# EAGLE design Bus Stop Kiosk Rev. 2 (EAGLE 7.4.0)
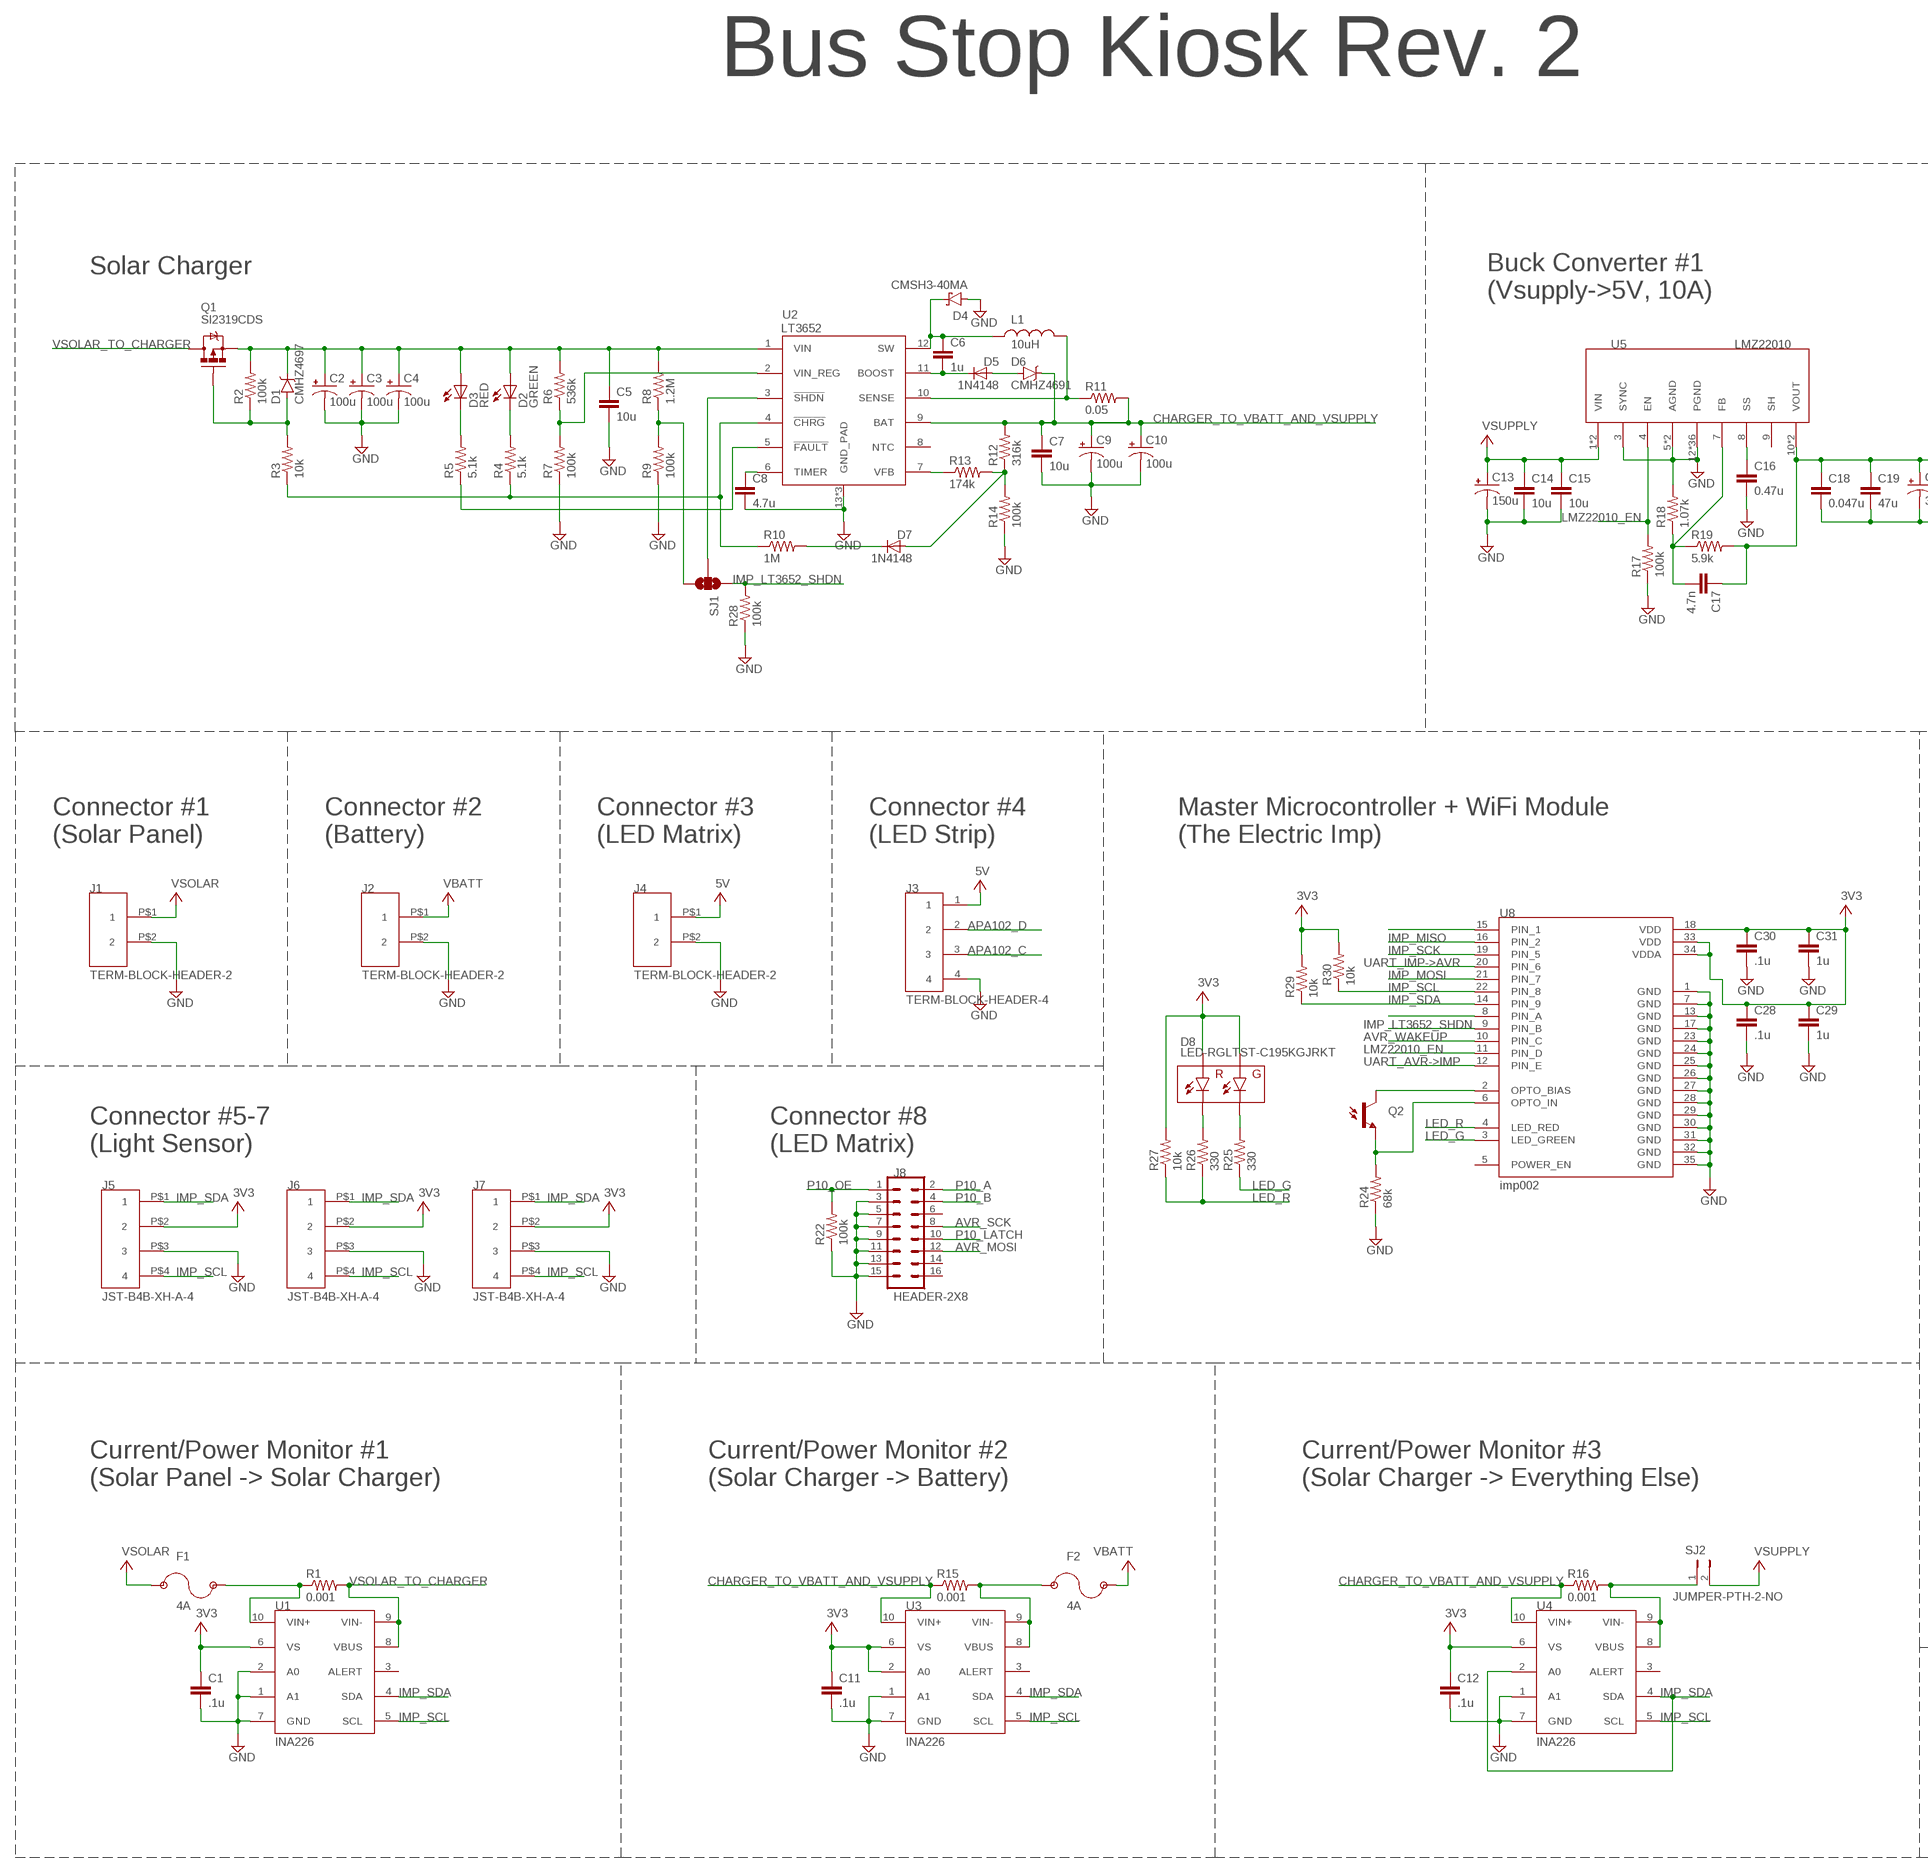
[diagram p0: schematic, sheet 1, part 1 of 2]
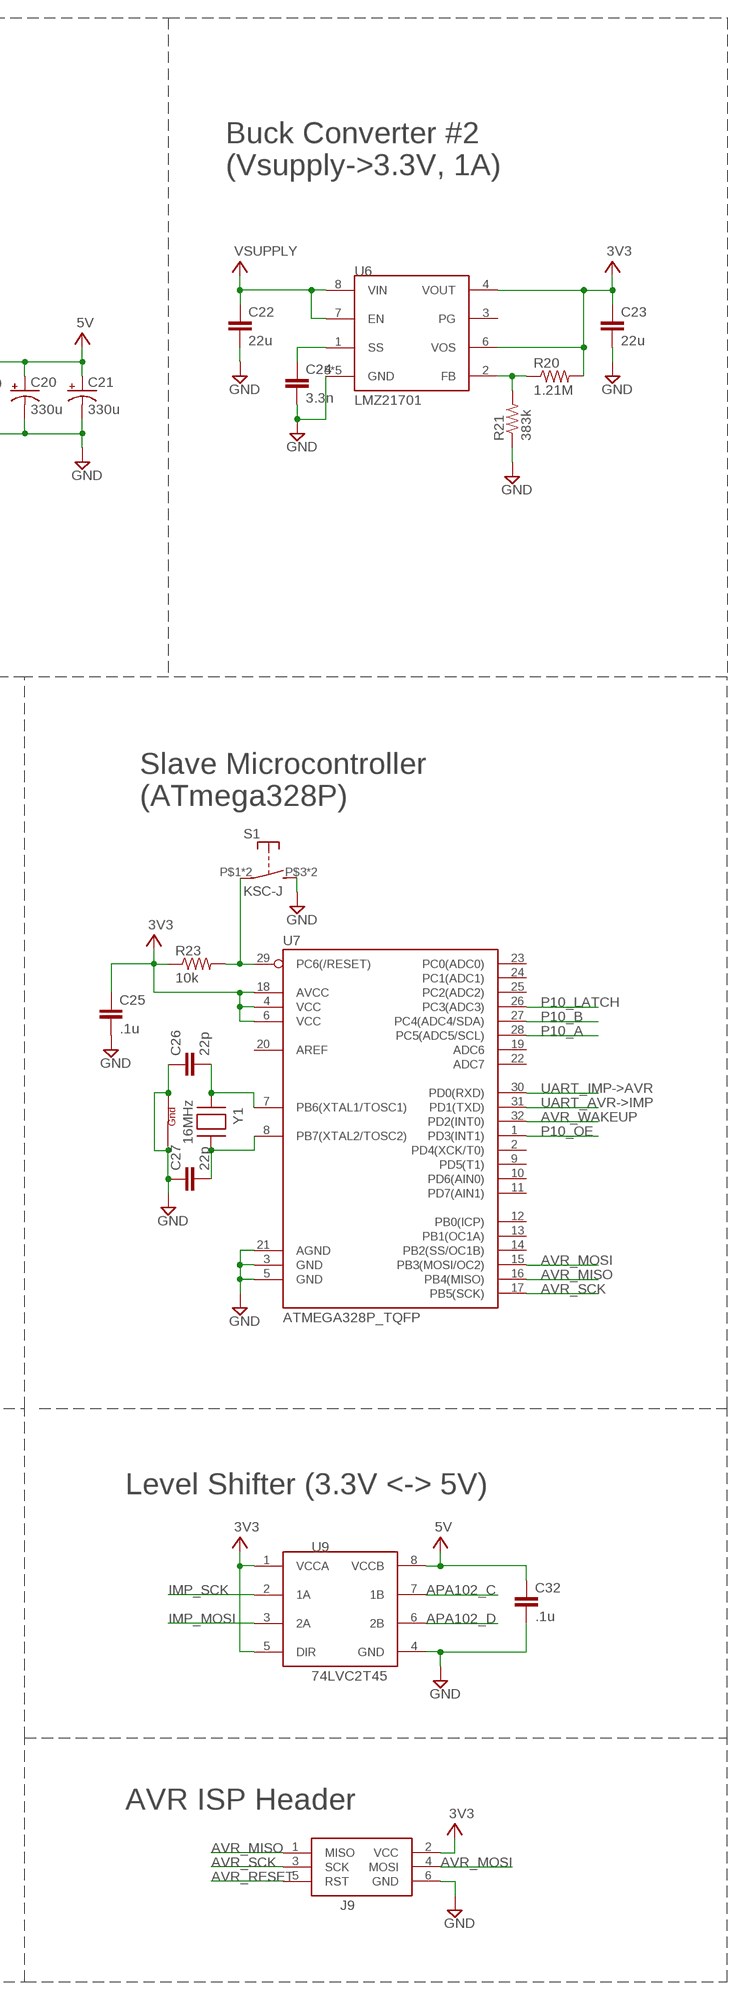
[diagram p1: schematic, sheet 1, part 2 of 2]

## Parts
C1  .1u  C-EUC0603K  [C0603K]
C2  100u  CAP_POL7343  [EIA7343]
C3  100u  CAP_POL7343  [EIA7343]
C4  100u  CAP_POL7343  [EIA7343]
C5  10u  C-EUC1210K  [C1210K]
C6  1u  C-EUC0805K  [C0805K]
C7  10u  C-EUC1210K  [C1210K]
C8  4.7u  C-EUC0603K  [C0603K]
C9  100u  CAP_POL7343  [EIA7343]
C10  100u  CAP_POL7343  [EIA7343]
C11  .1u  C-EUC0603K  [C0603K]
C12  .1u  C-EUC0603K  [C0603K]
C13  150u  CAP_POLG  [PANASONIC_G]
C14  10u  C-EUC1210K  [C1210K]
C15  10u  C-EUC1210K  [C1210K]
C16  0.47u  C-EUC0603K  [C0603K]
C17  4.7n  C-EUC0603K  [C0603K]
C18  0.047u  C-EUC1206K  [C1206K]
C19  47u  C-EUC1210K  [C1210K]
C20  330u  CAP_POL7343  [EIA7343]
C21  330u  CAP_POL7343  [EIA7343]
C22  22u  C-EUC1210K  [C1210K]
C23  22u  C-EUC0805K  [C0805K]
C24  3.3n  C-EUC0603K  [C0603K]
C25  .1u  C-EUC0603K  [C0603K]
C26  22p  C-EUC0603K  [C0603K]
C27  22p  C-EUC0603K  [C0603K]
C28  .1u  C-EUC0603K  [C0603K]
C29  1u  C-EUC0603K  [C0603K]
C30  .1u  C-EUC0603K  [C0603K]
C31  1u  C-EUC0603K  [C0603K]
C32  .1u  C-EUC0603K  [C0603K]
D1  CMHZ4697  [SOD-123]
D2  GREEN  LEDCHIP-LED0603  [CHIP-LED0603]
D3  RED  LEDCHIP-LED0603  [CHIP-LED0603]
D4  CMSH3-40MA  DIODE-SCHOTTKY-B340A  [SMA-DIODE]
D5  1N4148  [SOD-123]
D6  CMHZ4691  [SOD-123]
D7  1N4148  [SOD-123]
D8  LED-RGLTST-C195KGJRKT  [LTST-C195KGJRKT]
F1  4A  FUSE  [0603]
F2  4A  FUSE  [0603]
J1  TERM-BLOCK-HEADER-2  [TERM-BLOCK-HDR-2]
J2  TERM-BLOCK-HEADER-2  [TERM-BLOCK-HDR-2]
J3  TERM-BLOCK-HEADER-4  [OSTOQ045451]
J4  TERM-BLOCK-HEADER-2  [TERM-BLOCK-HDR-2]
J5  JST-B4B-XH-A-4  [JST-B4B-XH-A-4]
J6  JST-B4B-XH-A-4  [JST-B4B-XH-A-4]
J7  JST-B4B-XH-A-4  [JST-B4B-XH-A-4]
J8  HEADER-2X8  [HEADER-2X8-SHROUDED]
J9  AVRISP-6  [AVRISP]
L1  10uH  IHLP-2525CZ-01  [INDUCTOR-6.86X6.47]
Q1  SI2319CDS  [SOT-23-3]
Q2  PHOTOTRANSISTORPT17-21C-L41-TR8  [PT17-21C-L41-TR8]
R1  0.001  R-US_R1206  [R1206]
R2  100k  R-US_R0603  [R0603]
R3  10k  R-US_R0603  [R0603]
R4  5.1k  R-US_R0402  [R0402]
R5  5.1k  R-US_R0402  [R0402]
R6  536k  R-US_R0402  [R0402]
R7  100k  R-US_R0402  [R0402]
R8  1.2M  R-US_R0402  [R0402]
R9  100k  R-US_R0402  [R0402]
R10  1M  R-US_R0402  [R0402]
R11  0.05  R-US_R1206  [R1206]
R12  316k  R-US_R0603  [R0603]
R13  174k  R-US_R0402  [R0402]
R14  100k  R-US_R0603  [R0603]
R15  0.001  R-US_R1206  [R1206]
R16  0.001  R-US_R1206  [R1206]
R17  100k  R-US_R0603  [R0603]
R18  1.07k  R-US_R0603  [R0603]
R19  5.9k  R-US_R0603  [R0603]
R20  1.21M  R-US_R0603  [R0603]
R21  383k  R-US_R0603  [R0603]
R22  100k  R-US_R0603  [R0603]
R23  10k  R-US_R0603  [R0603]
R24  68k  R-US_R0603  [R0603]
R25  330  R-US_R0603  [R0603]
R26  330  R-US_R0603  [R0603]
R27  10k  R-US_R0603  [R0603]
R28  100k  R-US_R0603  [R0603]
R29  10k  R-US_R0603  [R0603]
R30  10k  R-US_R0603  [R0603]
S1  KSC-J  [C&K-KSC]
SJ1  JUMPER-PAD-3-NOYES_SILK  [PAD-JUMPER-3-NO_YES_SILK]
SJ2  JUMPER-PTH-2-NO  [PTH-JUMPER-2-NO_NO_SILK]
U1  INA226  [VSSOP-10]
U2  LT3652  [MSOP-12_GND]
U3  INA226  [VSSOP-10]
U4  INA226  [VSSOP-10]
U5  LMZ22010  [TO-PMOD-11]
U6  LMZ21701  [SIL0008E]
U7  ATMEGA328P_TQFP  [TQFP32-08]
U8  imp002  ELECTRIC_IMP_IMP002  [ELECTRIC_IMP_IMP002]
U9  74LVC2T45  [VSSOP-8]
Y1  16MHz  XTAL-4-3225  [NX3225]

## Nets
3V3: C1.1 C11.1 C12.1 C23.1 C25.1 C28.1 C29.1 C30.1 C31.1 D8.P$1(GA) D8.P$2(RA) J5.P$2 J6.P$2 J7.P$2 J9.2(VCC) R20.2 R23.1 R27.2 R29.2 R30.2 U1.6(VS) U3.2(A0) U3.6(VS) U4.6(VS) U6.4(VOUT) U6.6(VOS) U7.4(VCC) U7.6(VCC) U7.18(AVCC) U8.18(VDD) U8.33(VDD) U8.34(VDDA) U9.1(VCCA) U9.5(DIR)
5V: C17.1 C18.1 C19.1 C20.A(+) C21.A(+) C32.1 J3.1 J4.P$1 R19.2 U5.10(VOUT) U5.11(VOUT) U9.8(VCCB)
ADC1: U8.8(PIN_A)
APA102_C: J3.3 U9.7(1B)
APA102_D: J3.2 U9.6(2B)
AVR_MISO: J9.1(MISO) U7.16(PB4(MISO))
AVR_MOSI: J8.12 J9.4(MOSI) U7.15(PB3(MOSI/OC2))
AVR_RESET: J9.5(RST) R23.2 S1.P$1(P) S1.P$2(P) U7.29(PC6(/RESET))
AVR_SCK: J8.8 J9.3(SCK) U7.17(PB5(SCK))
AVR_WAKEUP: U7.32(PD2(INT0)) U8.10(PIN_C)
BOOST: C6.2 D5.C U2.11(BOOST)
C21: C26.2 U7.7(PB6(XTAL1/TOSC1)) Y1.1(X1)
CHARGER_TO_VBATT_AND_VSUPPLY: C7.1 C9.A(+) C10.A(+) D6.C R11.2 R12.2 R15.1 R16.1 U2.9(BAT) U3.10(VIN+) U4.10(VIN+)
CHRG: R3.1 R4.1 R10.1 U2.4(!CHRG)
FAULT: R5.1 U2.5(!FAULT)
GND: C1.2 C2.C(-) C3.C(-) C4.C(-) C5.2 C7.2 C8.2 C9.C(-) C10.C(-) C11.2 C12.2 C13.- C14.2 C15.2 C16.2 C18.2 C19.2 C20.C(-) C21.C(-) C22.2 C23.2 C24.2 C25.2 C26.1 C27.1 C28.2 C29.2 C30.2 C31.2 C32.2 D4.A J1.P$2 J2.P$2 J3.4 J4.P$2 J5.P$3 J6.P$3 J7.P$3 J8.3 J8.5 J8.7 J8.9 J8.11 J8.13 J8.15 J9.6(GND) R7.1 R9.1 R14.1 R17.1 R18.2 R21.1 R22.1 R24.1 R28.1 S1.P$3(S) S1.P$4(S) U1.1(A1) U1.2(A0) U1.7(GND) U2.13(GND_PAD) U2.P$1(GND_PAD) U2.P$2(GND_PAD) U3.1(A1) U3.7(GND) U4.1(A1) U4.7(GND) U5.3(SYNC) U5.5(AGND) U5.6(AGND) U5.12(PGND) U5.P$1(PGND) U5.P$2(PGND) U5.P$3(PGND) U5.P$4(PGND) U5.P$5(PGND) U5.P$6(PGND) U5.P$7(PGND) U5.P$8(PGND) U5.P$9(PGND) U5.P$10(PGND) U5.P$11(PGND) U5.P$12(PGND) U5.P$13(PGND) U5.P$14(PGND) U5.P$15(PGND) U5.P$16(PGND) U5.P$17(PGND) U5.P$18(PGND) U5.P$19(PGND) U5.P$20(PGND) U5.P$21(PGND) U5.P$22(PGND) U5.P$23(PGND) U5.P$24(PGND) U5.P$25(PGND) U5.P$26(PGND) U5.P$27(PGND) U5.P$28(PGND) U5.P$29(PGND) U5.P$30(PGND) U5.P$31(PGND) U5.P$32(PGND) U5.P$33(PGND) U5.P$34(PGND) U5.P$35(PGND) U6.5(GND) U6.9(GND) U6.10(GND) U6.11(GND) U6.12(GND) U7.3(GND) U7.5(GND) U7.21(AGND) U8.1(GND) U8.7(GND) U8.13(GND) U8.17(GND) U8.23(GND) U8.24(GND) U8.25(GND) U8.26(GND) U8.27(GND) U8.28(GND) U8.29(GND) U8.30(GND) U8.31(GND) U8.32(GND) U8.35(GND) U9.4(GND) Y1.2(G2) Y1.4(G1)
IMP_LT3652_SHDN: R28.2 SJ1.1 U8.9(PIN_B)
IMP_MISO: U8.16(PIN_2)
IMP_MOSI: U8.21(PIN_7) U9.3(2A)
IMP_SCK: U8.19(PIN_5) U9.2(1A)
IMP_SCL: J5.P$4 J6.P$4 J7.P$4 R30.1 U1.5(SCL) U3.5(SCL) U4.5(SCL) U8.22(PIN_8)
IMP_SDA: J5.P$1 J6.P$1 J7.P$1 R29.1 U1.4(SDA) U3.4(SDA) U4.2(A0) U4.4(SDA) U8.14(PIN_9)
LED_G: R25.1 U8.3(LED_GREEN)
LED_R: R26.1 R27.1 U8.4(LED_RED)
LMZ22010_EN: R17.2 U5.4(EN) U8.11(PIN_D)
N$1: Q2.C U8.2(OPTO_BIAS)
N$2: Q2.E R24.2 U8.6(OPTO_IN)
N$3: D8.P$3(GC) R25.2
N$4: D8.P$4(RC) R26.2
N$5: C24.1 U6.1(SS)
N$6: D7.C R10.2
N$7: C17.2 R18.1 R19.1 U5.7(FB)
N$8: C16.1 U5.8(SS)
N$9: R20.1 R21.2 U6.2(FB)
N$10: R8.1 R9.2 SJ1.3
N$11: D7.A R12.1 R13.2 R14.2
N$12: U8.15(PIN_1)
N$13: D3.C R5.2
N$15: D1.A Q1.1(G) R2.1 R3.2
N$16: D2.C R4.2
N$19: C27.2 U7.8(PB7(XTAL2/TOSC2)) Y1.3(X2)
N$21: D5.A D6.A
N$23: F1.2 R1.1 U1.10(VIN+)
N$25: R16.2 SJ2.1 U4.8(VBUS) U4.9(VIN-)
N$33: F2.1 R15.2 U3.8(VBUS) U3.9(VIN-)
P10_A: J8.2 U7.28(PC5(ADC5/SCL))
P10_B: J8.4 U7.27(PC4(ADC4/SDA))
P10_LATCH: J8.10 U7.26(PC3(ADC3))
P10_OE: J8.1 R22.2 U7.1(PD3(INT1))
SENSE: L1.P$2 R11.1 U2.10(SENSE)
SHDN: SJ1.2 U2.3(!SHDN)
SW: C6.1 D4.C L1.P$1 U2.12(SW)
TIMER: C8.1 U2.6(TIMER)
UART_AVR->IMP: U7.31(PD1(TXD)) U8.12(PIN_E)
UART_IMP->AVR: U7.30(PD0(RXD)) U8.20(PIN_6)
VBATT: F2.2 J2.P$1
VFB: R13.1 U2.7(VFB)
VIN: C2.A(+) C3.A(+) C4.A(+) C5.1 D1.C D2.A D3.A Q1.2(S) R2.2 R6.2 R8.2 U2.1(VIN)
VIN_REG: R6.1 R7.2 U2.2(VIN_REG)
VSOLAR: F1.1 J1.P$1
VSOLAR_TO_CHARGER: Q1.3(D) R1.2 U1.8(VBUS) U1.9(VIN-)
VSUPPLY: C13.+ C14.1 C15.1 C22.1 SJ2.2 U5.1(VIN) U5.2(VIN) U6.7(EN) U6.8(VIN)
Unconnected: J8.6 J8.14 J8.16 U1.3(ALERT) U2.8(NTC) U3.3(ALERT) U4.3(ALERT) U5.9(SH) U6.3(PG) U7.2(PD4(XCK/T0)) U7.9(PD5(T1)) U7.10(PD6(AIN0)) U7.11(PD7(AIN1)) U7.12(PB0(ICP)) U7.13(PB1(OC1A)) U7.14(PB2(SS/OC1B)) U7.19(ADC6) U7.20(AREF) U7.22(ADC7) U7.23(PC0(ADC0)) U7.24(PC1(ADC1)) U7.25(PC2(ADC2)) U8.5(POWER_EN)

## Notes on the sheet
- Bus Stop Kiosk Rev. 2
- Solar Charger
- Buck Converter #1
  (Vsupply->5V, 10A)
- Buck Converter #2
  (Vsupply->3.3V, 1A)
- Connector #1
  (Solar Panel)
- Connector #2
  (Battery)
- Connector #3
  (LED Matrix)
- Connector #4
  (LED Strip)
- Master Microcontroller + WiFi Module
  (The Electric Imp)
- Slave Microcontroller
  (ATmega328P)
- Connector #5-7
  (Light Sensor)
- Connector #8
  (LED Matrix)
- Level Shifter (3.3V <-> 5V)
- Current/Power Monitor #1
  (Solar Panel -> Solar Charger)
- Current/Power Monitor #2
  (Solar Charger -> Battery)
- Current/Power Monitor #3
  (Solar Charger -> Everything Else)
- AVR ISP Header

## Library data of the parts
C1 C5-C8 C11 C12 C14-C19 C22-C32 = resistor:C-EU: CAPACITOR, European symbol
C2-C4 C9 C10 C20 C21 = SparkFun-Capacitors:CAP_POL: Capacitor Polarized These are standard SMD and PTH capacitors. Normally 10uF, 47uF, and 100uF in electrolytic and tantalum varieties. Always verify the external diameter of the through hole cap, it varies with capacity, voltage, and manufacturer. The EIA devices should be standard.; PROD_ID: CAP-08702
C13 = SparkFun-Capacitors:CAP_POL: Capacitor Polarized These are standard SMD and PTH capacitors. Normally 10uF, 47uF, and 100uF in electrolytic and tantalum varieties. Always verify the external diameter of the through hole cap, it varies with capacity, voltage, and manufacturer. The EIA devices should be standard.
D1 = JL:CMHZ4697
D2 D3 = adafruit:LED: LED OSRAM: - CHIPLED LG R971, LG N971, LY N971, LG Q971, LY Q971, LO R971, LY R971 LH N974, LH R974 LS Q976, LO Q976, LY Q976 LO Q996 - Hyper CHIPLED LW Q18S LB Q993, LB Q99A, LB R99A - SideLED LS A670, LO A670, LY A670, LG A670, LP A670 LB A673, LV A673, LT A673, LW A673 LH A674 LY A675 LS A676, LA A676, LO A676, LY A676, LW A676 LS A679, LY A679, LG A679 - Hyper Micro SIDELED® LS Y876, LA Y876, LO Y876, LY Y876 LT Y87S - SmartLED LW L88C, LW L88S LB L89C, LB L89S, LG L890 LS L89K, LO L89K, LY L89K LS L896, LA L896, LO L896, LY L896 - TOPLED LS T670, LO T670, LY T670, LG T670, LP T670 LSG T670, LSP T670, LSY T670, LOP T670, LYG T670 LG T671, LOG T671, LSG T671 LB T673, LV T673, LT T673, LW T673 LH T674 LS T676, LA T676, LO T676, LY T676, LB T676, LH T676, LSB T676, LW T676 LB T67C, LV T67C, LT T67C, LS T67K, LO T67K, LY T67K, LW E67C LS E67B, LA E67B, LO E67B, LY E67B, LB E67C, LV E67C, LT E67C LW T67C LS T679, LY T679, LG T679 LS T770, LO T770, LY T770, LG T770, LP T770 LB T773, LV T773, LT T773, LW T773 LH T774 LS E675, LA E675, LY E675, LS T675 LS T776, LA T776, LO T776, LY T776, LB T776 LHGB T686 LT T68C, LB T68C - Hyper Mini TOPLED® LB M676 - Mini TOPLED Santana® LG M470 LS M47K, LO M47K, LY M47K Source: http://www.osram.convergy.de/
D4 = SparkFun-DiscreteSemi:DIODE-SCHOTTKY: Schottky diodes in SFE's production catalog BAT20J 1A 23V 0.62Vf RB751 120mA 40V 0.37Vf PMEG4005EJ 0.5A 40V 0.42Vf MBRA140 1A 40V 0.5Vf B340A 3A 40V SMA; PROD_ID: DIO-09886; VALUE: B340A
D5 D7 = JL:1N4148
D6 = JL:CMHZ4691
D8 = SparkFun-LED:LED-RG; PROD_ID: DIO-12140
F1 F2 = JL:FUSE
J1 J2 J4 = JL:TERM-BLOCK-HEADER-2
J3 = JL:TERM-BLOCK-HEADER-4
J5-J7 = JL:JST-B4B-XH-A-4
J8 = JL:HEADER-2X8
J9 = adafruit:AVRISP: AVR ISP HEADER Standard 6 pin header for AVR programming
L1 = JL:IHLP-2525CZ-01
Q1 = JL:SI2319CDS
Q2 = SparkFun-DiscreteSemi:PHOTOTRANSISTOR; PROD_ID: TRANS-12141
R1-R30 = resistor:R-US_: RESISTOR, American symbol
S1 = JL:KSC-J
SJ1 = SparkFun-Passives:JUMPER-PAD-3-NO
SJ2 = SparkFun-Passives:JUMPER-PTH-2-NO
U1 U3 U4 = JL:INA226
U2 = SparkFun-PowerIC:LT3652: LT3652 MPPT Solar Charge Controller 5V-32V smart charger for batteries up to 14.4V
U5 = JL:LMZ22010
U6 = JL:LMZ21701
U7 = SparkFun-DigitalIC:ATMEGA328P_TQFP; PROD_ID: IC-09069
U8 = SparkFun-DigitalIC:ELECTRIC_IMP_IMP002; PROD_ID: IC-12130
U9 = JL:74LVC2T45
Y1 = adafruit:XTAL-4: Classic 4-pin 3.2 x 2.5mm crystal

## Board
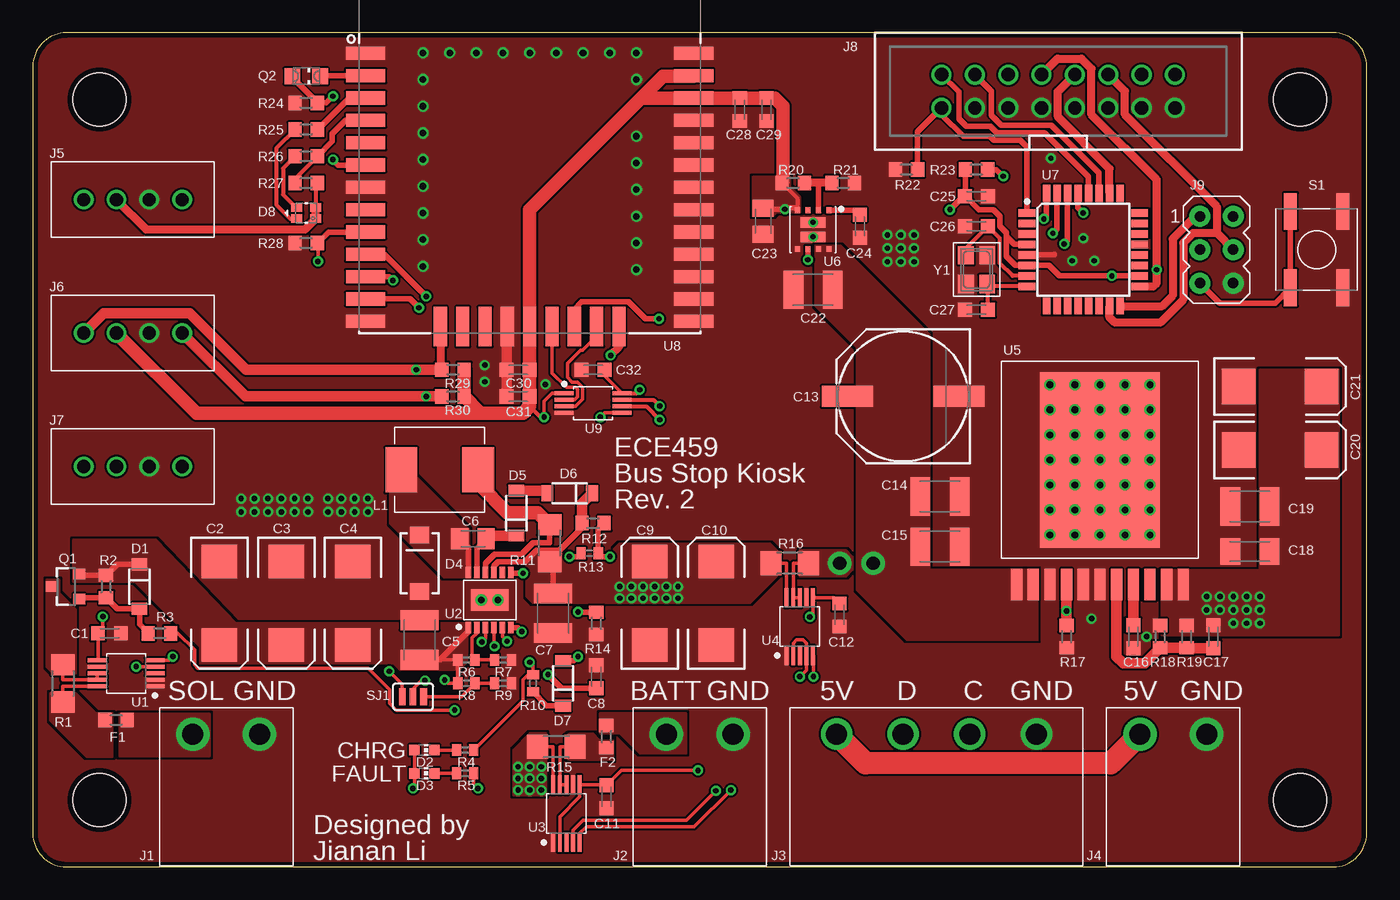
[diagram p2: board, top side]
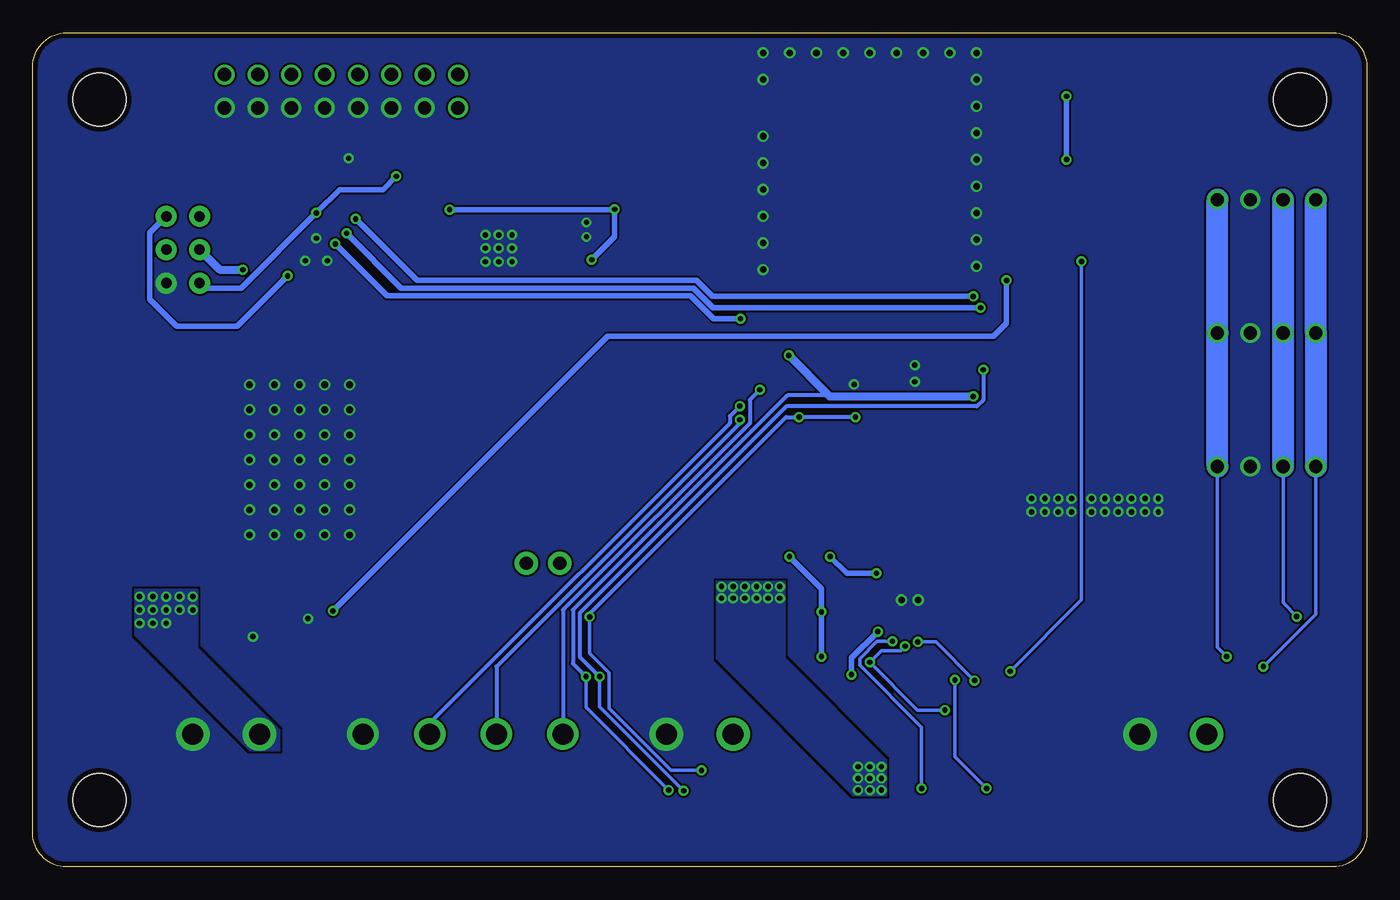
[diagram p3: board, bottom side, seen from below]

Size 101.6 x 63.5 mm. Coordinates in mm from the lower left corner, seen from the top.
Outline: 0,60.96 0,2.54 arc90 2.54,0 99.06,0 arc90 101.6,2.54 101.6,60.96 arc90 99.06,63.5 2.54,63.5 arc90 0,60.96
Copper layers (1*16): Top 0.0356mm / dielectric 1.5011mm / Bottom 0.0356mm
Design rules "LaenPCBOrder *": minimum track width 6mil, minimum drill 15mil, track to track 6mil, track to pad 6mil, pad to pad 6mil, via to via 6mil, smd to smd 6mil, copper to edge 15mil, drill to drill 6mil, minimum pad ring 7mil, minimum via ring 7mil, stop-mask expansion 0mil, vias tented up to drill 60mil, thermal gap 10mil
Holes 4.06 mm at 5.08,5.08 96.52,5.08 96.52,58.42 5.08,58.42

### Footprints (pad centres in the part's own frame; a part is rotated, then mirrored left to right if it is on the bottom)
C0603K = smd 1.05 x 1.08: 1 -0.875,0; 2 0.875,0
EIA7343 = smd 2.55 x 2.7: A 3.17,0; C -3.17,0
C1210K = smd 1.5 x 2.9: 1 -1.5,0; 2 1.5,0
C0805K = smd 1.3 x 1.6: 1 -1,0; 2 1,0
PANASONIC_G = smd 3.9 x 1.6: + 4.25,0; - -4.25,0
C1206K = smd 1.5 x 2: 1 -1.5,0; 2 1.5,0
SOD-123 = smd 0.9 x 1.2: A 1.7,0; C -1.7,0
CHIP-LED0603 = smd 0.8 x 0.8: A 0,-0.75; C 0,0.75
SMA-DIODE = smd 1.27 x 1.47: A -2.15,0; C 2.15,0
LTST-C195KGJRKT = smd 0.65 x 0.85: P$1 0.425,0.725; P$2 -0.425,0.725; P$3 0.425,-0.725; P$4 -0.425,-0.725
0603 = smd 1 x 1.1: 1 -0.85,0; 2 0.85,0
TERM-BLOCK-HDR-2 = drill 1.6 pad 2.54: P$1 -2.54,4; P$2 2.54,4
OSTOQ045451 = drill 1.6: 1 -7.62,4; 2 -2.54,4; 3 2.54,4; 4 7.62,4
JST-B4B-XH-A-4 = drill 1: P$1 -3.75,0; P$2 -1.25,0; P$3 1.25,0; P$4 3.75,0
HEADER-2X8-SHROUDED = drill 1.016: 1 -1.27,8.89; 2 1.27,8.89; 3 -1.27,6.35; 4 1.27,6.35; 5 -1.27,3.81; 6 1.27,3.81; 7 -1.27,1.27; 8 1.27,1.27; 9 -1.27,-1.27; 10 1.27,-1.27; 11 -1.27,-3.81; 12 1.27,-3.81; 13 -1.27,-6.35; 14 1.27,-6.35; 15 -1.27,-8.89; 16 1.27,-8.89
AVRISP = drill 0.8 pad 1.6: 1 -1.27,2.54; 2 1.27,2.54; 3 -1.27,0; 4 1.27,0; 5 -1.27,-2.54; 6 1.27,-2.54
INDUCTOR-6.86X6.47 = smd 2.413 x 3.429: P$1 -2.921,0; P$2 2.921,0
SOT-23-3 = smd 0.8 x 0.9: 1 -0.95,-1; 2 0.95,-1; 3 0,1.1
PT17-21C-L41-TR8 = smd 1.2 x 1.2: C 0,1.05; E 0,-1.05
R1206 = smd 1.6 x 1.803: 1 -1.422,0; 2 1.422,0
R0603 = smd 1 x 1.1: 1 -0.85,0; 2 0.85,0
R0402 = smd 0.7 x 0.9: 1 -0.65,0; 2 0.65,0
C&K-KSC = smd 2.8 x 1: P$1 -2.9,2; P$2 2.9,2; P$3 -2.9,-2; P$4 2.9,-2
PAD-JUMPER-3-NO_YES_SILK = smd 0.508 x 1.27: 1 -0.813,0; 2 0,0; 3 0.813,0
PTH-JUMPER-2-NO_NO_SILK = drill 1.016 pad 1.778: 1 -1.27,0; 2 1.27,0
VSSOP-10 = smd 0.3 x 1.45: 1 -1,-2.2; 2 -0.5,-2.2; 3 0,-2.2; 4 0.5,-2.2; 5 1,-2.2; 6 1,2.2; 7 0.5,2.2; 8 0,2.2; 9 -0.5,2.2; 10 -1,2.2
MSOP-12_GND = smd 0.889 x 0.42: 1 -2.1,1.625; 2 -2.1,0.975; 3 -2.1,0.325; 4 -2.1,-0.325; 5 -2.1,-0.975; 6 -2.1,-1.625; 7 2.1,-1.625; 8 2.1,-0.975; 9 2.1,-0.325; 10 2.1,0.325; 11 2.1,0.975; 12 2.1,1.625 | smd 1.651 x 2.845: 13 0,0 | drill 0.5: P$1 0,0.635; P$2 0,-0.635
TO-PMOD-11 = smd 0.86 x 2.41: 1 -6.35,-9.5; 2 -5.08,-9.5; 3 -3.81,-9.5; 4 -2.54,-9.5; 5 -1.27,-9.5; 6 0,-9.5; 7 1.27,-9.5; 8 2.54,-9.5; 9 3.81,-9.5; 10 5.08,-9.5; 11 6.35,-9.5 | smd 9.126 x 13.37: 12 0,0 | drill 0.5: P$1 -3.81,5.715; P$2 -1.905,5.715; P$3 0,5.715; P$4 1.905,5.715; P$5 3.81,5.715; P$6 -3.81,3.81; P$7 -1.905,3.81; P$8 0,3.81; P$9 1.905,3.81; P$10 3.81,3.81; P$11 -3.81,1.905; P$12 -1.905,1.905; P$13 0,1.905; P$14 1.905,1.905; P$15 3.81,1.905; P$16 -3.81,0; P$17 -1.905,0; P$18 0,0; P$19 1.905,0; P$20 3.81,0; P$21 -3.81,-1.905; P$22 -1.905,-1.905; P$23 0,-1.905; P$24 1.905,-1.905; P$25 3.81,-1.905; P$26 -3.81,-3.81; P$27 -1.905,-3.81; P$28 0,-3.81; P$29 1.905,-3.81; P$30 3.81,-3.81; P$31 -3.81,-5.715; P$32 -1.905,-5.715; P$33 0,-5.715; P$34 1.905,-5.715; P$35 3.81,-5.715
SIL0008E = smd 0.45 x 0.4: 1 -1.475,1.2; 2 -1.475,0.4; 3 -1.475,-0.4; 4 -1.475,-1.2; 5 1.475,-1.2; 6 1.475,-0.4; 7 1.475,0.4; 8 1.475,1.2 | smd 0.8 x 1.9: 9 -0.55,0; 10 0.55,0 | drill 0.381 pad 0.61: 11 -0.55,0; 12 0.55,0
TQFP32-08 = smd 1.27 x 0.559: 1 -4.293,2.8; 2 -4.293,2; 3 -4.293,1.2; 4 -4.293,0.4; 5 -4.293,-0.4; 6 -4.293,-1.2; 7 -4.293,-2; 8 -4.293,-2.8; 17 4.293,-2.8; 18 4.293,-2; 19 4.293,-1.2; 20 4.293,-0.4; 21 4.293,0.4; 22 4.293,1.2; 23 4.293,2; 24 4.293,2.8 | smd 0.559 x 1.27: 9 -2.8,-4.293; 10 -2,-4.293; 11 -1.2,-4.293; 12 -0.4,-4.293; 13 0.4,-4.293; 14 1.2,-4.293; 15 2,-4.293; 16 2.8,-4.293; 25 2.8,4.293; 26 2,4.293; 27 1.2,4.293; 28 0.4,4.293; 29 -0.4,4.293; 30 -1.2,4.293; 31 -2,4.293; 32 -2.8,4.293
ELECTRIC_IMP_IMP002 = smd 3 x 1: 1 -12.5,5.8; 2 -12.5,4.1; 3 -12.5,2.4; 4 -12.5,0.7; 5 -12.5,-1; 6 -12.5,-2.7; 7 -12.5,-4.4; 8 -12.5,-6.1; 9 -12.5,-7.8; 10 -12.5,-9.5; 11 -12.5,-11.2; 12 -12.5,-12.9; 13 -12.5,-14.6; 23 12.5,-14.6; 24 12.5,-12.9; 25 12.5,-11.2; 26 12.5,-9.5; 27 12.5,-7.8; 28 12.5,-6.1; 29 12.5,-4.4; 30 12.5,-2.7; 31 12.5,-1; 32 12.5,0.7; 33 12.5,2.4; 34 12.5,4.1; 35 12.5,5.8 | smd 1 x 3: 14 -6.8,-15; 15 -5.1,-15; 16 -3.4,-15; 17 -1.7,-15; 18 0,-15; 19 1.7,-15; 20 3.4,-15; 21 5.1,-15; 22 6.8,-15
VSSOP-8 = smd 0.3 x 1.45: 1 -0.75,-2.2; 2 -0.25,-2.2; 3 0.25,-2.2; 4 0.75,-2.2; 5 0.75,2.2; 6 0.25,2.2; 7 -0.25,2.2; 8 -0.75,2.2
NX3225 = smd 1.4 x 1.2: 1 -1.1,-0.8; 2 1.1,-0.8; 3 1.1,0.8; 4 -1.1,0.8

### Placement (x,y rotation side)
C1  5.84,17.78 0 top
C2  14.22,20.07 270 top
C3  19.3,20.07 270 top
C4  24.38,20.07 270 top
C5  29.46,17.27 90 top
C6  33.53,24.97 0 top
C7  39.62,19.3 270 top
C8  42.93,14.48 90 top
C9  46.99,20.07 90 top
C10  52.07,20.07 90 top
C11  43.69,5.33 270 top
C12  61.44,19.18 270 top
C13  66.29,35.81 180 top
C14  69.09,28.19 0 top
C15  69.09,24.38 0 top
C16  83.82,17.53 270 top
C17  89.92,17.53 270 top
C18  92.71,24 180 top
C19  92.71,27.43 180 top
C20  95,31.75 0 top
C21  95,36.58 0 top
C22  59.44,43.94 180 top
C23  55.63,49.15 270 top
C24  62.99,48.77 270 top
C25  71.88,51.05 0 top
C26  71.88,48.77 0 top
C27  71.88,42.42 0 top
C28  53.85,57.66 270 top
C29  55.88,57.66 270 top
C30  36.96,37.85 180 top
C31  36.96,35.81 180 top
C32  42.67,37.85 180 top
D1  8.13,21.34 270 top
D2  29.82,8.89 270 top
D3  29.82,7.11 270 top
D4  29.46,23.11 90 top
D5  36.83,26.92 90 top
D6  40.89,28.45 180 top
D7  40.39,13.97 90 top
D8  20.83,49.78 270 top
F1  6.35,11.18 180 top
F2  43.69,9.91 90 top
J1  14.73,6.1 0 top
J2  50.8,6.1 0 top
J3  68.83,6.1 0 top
J4  86.87,6.1 0 top
J5  7.62,50.8 0 top
J6  7.62,40.64 0 top
J7  7.62,30.48 0 top
J8  78.11,59.05 90 top
J9  90.17,46.99 0 top
L1  30.99,30.23 0 top
Q1  2.54,21.34 90 top
Q2  20.83,60.2 270 top
R1  2.29,13.97 90 top
R2  5.59,21.34 90 top
R3  9.65,17.78 180 top
R4  32.92,8.89 180 top
R5  32.92,7.11 180 top
R6  33.02,15.75 180 top
R7  35.81,15.75 180 top
R8  33.02,13.97 180 top
R9  35.81,13.97 180 top
R10  38.1,13.97 270 top
R11  39.37,24.64 270 top
R12  42.67,26.16 180 top
R13  42.42,23.88 0 top
R14  42.93,18.54 90 top
R15  39.88,9.14 0 top
R16  57.66,23.11 0 top
R17  78.74,17.53 90 top
R18  85.85,17.53 90 top
R19  87.88,17.53 90 top
R20  57.91,52.07 180 top
R21  61.72,52.07 180 top
R22  66.55,53.09 0 top
R23  71.88,53.09 0 top
R24  20.83,58.17 0 top
R25  20.83,56.13 180 top
R26  20.83,54.1 180 top
R27  20.83,52.07 0 top
R28  20.83,47.5 0 top
R29  32,37.85 0 top
R30  32,35.81 0 top
S1  97.79,46.99 90 top
SJ1  28.96,12.95 0 top
SJ2  62.74,23.11 0 top
U1  7.11,14.73 90 top
U2  34.8,20.32 90 top
U3  40.64,4.06 0 top
U4  58.42,18.29 0 top
U5  81.28,30.99 0 top
U6  59.44,48.51 270 top
U7  80.01,46.99 0 top
U8  37.85,56.13 0 top
U9  42.67,35.31 270 top
Y1  71.88,45.47 270 top

### Tracks (layer width: path | path; a pad name or v marks a point on that pad's centre or on a via)
3V3  (via drill 0.41)
  Top 0.254: U1.6 4.97,15.73 C1.1 5.33,18.15 v5.33,19.05 | C12.1 61.01,20.49 U4.6 59.42,19.26 v59.18,19.02 | U3.2 40.14,3.82 41.64,5.32 U3.6 43.69,6.26 C11.1 44.83,7.34 v50.66,7.34 | 38.1,37.58 C30.1 | U9.1 39.54,36.06 38.94,35.46 v38.94,34.24 | U9.5 43.55,34.56 v43.23,34.24
  Top 0.305: R27.2 21.55,51.95 D8.P$2 | R20.2 58.24,50.9 U6.4 | 37.85,35.05 38.66,34.24 v38.94,34.24
  Top 0.406: U7.18 v82.19,44.99 78.2,44.99 77.4,45.79 U7.6 74.86,45.79 74.17,46.48 74.17,48.01 | U6.6 v59.04,46.23 v59.03,46.23 | 70.87,51.05 v69.85,50.04 | R23.1 71.03,51.08 | 71.03,51.08 C25.1 | 71.03,51.08 72.07,50.04 73.15,50.04 73.66,49.53 73.66,48.77 74.17,48.26 74.17,48.01 | U6.4 58.06,50.16 57.38,50.16 v57.28,50.06 55.71,50.06 C23.1 | U7.4 74.78,47.39 74.17,48.01
  Top 0.61: U8.18 37.83,41.12 | 50.31,60.2 U8.34 | 46.49,58.53 46.42,58.61 | C28.1 | D8.P$2 D8.P$1 20.73,48.54 8.63,48.54 J5.P$2 | 70.87,51.05 C25.1
  Top 0.813: C31.1 37.85,35.8 37.85,35.05
  Top 1.016: C28.1 C29.1 56.53,58.53 57.15,57.91 57.15,52.16 R20.2 | 37.83,41.12 C30.1 C31.1 | U8.18 37.85,50.04 46.42,58.61 48.01,60.2 50.31,60.2 | 46.49,58.53 U8.33 C28.1 | R29.2 R30.2 34.12,34.54 | 37.85,35.05 37.34,34.54 34.12,34.54 | J6.P$2 12.47,34.54 34.12,34.54
  Bottom 0.254: v59.18,19.02 59.18,16.26 57.71,14.78 57.71,12.06 52.98,7.34 v50.66,7.34 | v5.33,19.05 6.37,20.09 J7.P$2
  Bottom 0.305: v38.94,34.24 v43.23,34.24 44.22,34.24 59.18,19.28 v59.18,19.02
  Bottom 0.406: J9.2 92.71,48.26 92.71,43.23 90.63,41.15 86.04,41.15 v82.19,44.99 | v59.03,46.23 57.28,47.98 v57.28,50.06 57.3,50.04 v69.85,50.04
  Bottom 1.676: J5.P$2 J6.P$2 J7.P$2
  pour Top (no thermals): 58.42,49.78 56.64,49.78 56.39,49.53 54.86,49.53 54.86,52.58 57.4,52.58 57.66,52.58 57.66,51.82 58.42,51.05
5V  (via drill 0.41)
  Top 0.254: U9.8 43.55,37.38 C32.1
  Top 0.305: U9.8 45.96,36.06 v46.23,36.32
  Top 1.676: J4.P$1 82.11,7.87 63.44,7.87 J3.1
  Bottom 0.305: v46.23,36.32 46.99,35.56 46.99,33.78 61.21,19.56 J3.1
  other vias: 89.41,20.57 89.41,19.56 90.42,20.57 90.42,19.56 91.44,19.56 91.44,18.54 92.46,18.54 93.47,18.54 93.47,19.56 92.46,19.56 91.44,20.57 92.46,20.57 93.47,20.57
  pour Top (no thermals): 86,22.63 93.47,22.61 93.47,37.87 99.47,37.87 99.47,17.6 86,17.6
  pour Bottom (no thermals): 82.8,8.89 82.8,10.41 89.03,16.64 89.03,21.08 93.85,21.08 93.85,17.65 85.09,8.89
APA102_C  (via drill 0.41)
  Top 0.305: U9.7 47.27,35.56 v47.75,35.08
  Bottom 0.305: J3.3 71.37,10.92 48.51,33.78 48.51,34.31 v47.75,35.08
APA102_D  (via drill 0.41)
  Top 0.305: U9.6 46.73,35.06 v47.75,34.04
  Bottom 0.305: J3.2 66.29,15.24 47.75,33.78 v47.75,34.04
AVR_MISO
  Top 0.61: J9.1 88.54,49.53 86.82,47.8 86.82,43.48 86.03,42.7 U7.16
AVR_MOSI
  Top 0.61: J8.12 83.19,59.05 83.19,57.28 90.17,50.29 90.17,48.26 | 90.17,48.26 J9.4 | 90.17,48.26 88.39,48.26 87.63,47.5 87.63,43.18 85.88,41.43 82.42,41.43 82.01,41.84 U7.15
AVR_RESET  (via drill 0.41)
  Top 0.406: S1.P$2 S1.P$1 94.63,42.93 90.42,42.93 J9.5 | U7.29 79.61,50.18 v80.01,49.78 | R23.2 73.41,53.09 v73.91,52.58
  Bottom 0.406: J9.5 88.52,44.07 85.72,44.07 v80.01,49.78 78.23,51.56 74.93,51.56 v73.91,52.58
AVR_SCK  (via drill 0.41)
  Top 0.61: J8.8 78.05,61.54 79.88,61.54 80.64,60.78 80.64,57.28 85.6,52.32 v85.6,45.47 85.6,44.45 85.34,44.19 U7.17
  Bottom 0.61: J9.3 87.38,45.47 v85.6,45.47
AVR_WAKEUP  (via drill 0.41)
  Top 0.406: U8.10 26.77,46.63 v29.97,43.43 | v77.01,49.33 77.21,49.52 U7.32
  Bottom 0.406: v29.97,43.43 49.84,43.43 51.05,44.65 72.34,44.65 v77.01,49.33
BOOST
  Top 0.406: U2.11 33.82,24.26 C6.2
  Top 0.813: D5.C 34.78,25.22 C6.2
C21
  Top 0.305: U7.7 74.64,44.99 73.66,45.97 73.66,47.87 C26.2 71.08,47.09 Y1.1
CHARGER_TO_VBATT_AND_VSUPPLY  (via drill 0.41)
  Top 0.254: U4.10 57.42,23.11 R16.1 | U3.10 39.64,9.14 R15.1
  Top 0.406: U2.9 35.12,22.93 35.43,23.24 37.49,23.24 38.35,24.11 39.37,24.11 | 39.37,24.11 39.37,23.62 | 39.37,23.62 R11.2 | C7.1 39.62,23.37 39.37,23.62 | 39.37,24.11 40.11,24.11 41.82,25.82 R12.2
  Top 0.813: D6.C 41.82,27.68 R12.2
  other vias: 36.96,5.84 37.85,5.84 38.73,5.84 36.96,6.73 37.85,6.73 38.73,6.73 36.96,7.62 37.85,7.62 38.73,7.62 44.7,20.45 45.59,20.45 46.48,20.45 47.37,20.45 48.26,20.45 49.15,20.45 44.7,21.34 45.59,21.34 46.48,21.34 47.37,21.34 48.26,21.34 49.15,21.34
  pour Top (no thermals): 38.35,23.88 43.94,23.88 44.7,24.64 56.13,24.64 56.9,23.88 56.9,22.35 54.61,20.07 38.1,20.07 37.59,20.57 37.59,23.11
  pour Top (no thermals): 39.12,10.16 37.85,10.16 36.58,8.89 36.58,5.46 39.12,5.46
  pour Bottom (no thermals): 36.58,5.46 36.58,8.13 44.32,15.88 44.32,21.72 49.53,21.72 49.53,15.88 39.12,5.46
CHRG  (via drill 0.41)
  Top 0.254: U2.4 35.12,16.82 v35.15,16.79 | v37.85,15.57 38.1,15.32 R10.1 37.73,14.62 37.34,14.22 37.34,12.66 R4.1 | R3.1 11.05,17.78 12.32,16.51 12.32,15.37 12.57,15.11 25.53,15.11 27.18,13.46 27.18,12.45 27.69,11.94 v32.13,11.94
  Bottom 0.254: v35.15,16.79 35.48,16.46 36.96,16.46 v37.85,15.57 34.21,11.94 v32.13,11.94
FAULT  (via drill 0.41)
  Top 0.254: U2.5 35.77,17.52 v36.12,17.17 | 33.53,7.11 R5.1 33.57,6.31 v33.91,5.97
  Bottom 0.254: v36.12,17.17 37.29,17.17 38.61,15.85 38.61,15.34 33.91,10.64 v33.91,5.97
GND  (via drill 0.41, 0.5)
  Top 0.406: U7.5 77.83,46.59 77.83,46.63 | U7.3 75.64,48.19
  Top 0.813: U8.17 36.08,41.07 C30.2 C31.2
  other vias: 37.85,61.98 35.81,61.98 33.78,61.98 31.75,61.98 29.72,61.98 39.88,61.98 41.91,61.98 43.94,61.98 45.97,61.98 29.72,59.94 29.72,57.91 29.72,55.88 29.72,53.85 29.72,51.82 29.72,49.78 29.72,47.75 29.72,45.72 45.97,59.94 45.97,55.63 45.97,53.59 45.97,51.56 45.97,49.53 45.97,47.5 45.97,45.47 84.84,17.53 80.64,18.9 77.55,53.95 34.42,38.2 34.42,36.93 79.17,46.15 80.85,46.15 80.01,47.85 39.04,36.73 65.1,48.11 66.12,48.11 67.13,48.11 65.1,47.09 66.12,47.09 67.13,47.09 65.1,46.08 66.12,46.08 67.13,46.08 15.88,27.03 16.89,27.03 17.91,27.03 18.92,27.03 19.94,27.03 20.95,27.03 22.48,27.03 23.5,27.03 24.51,27.03 25.53,27.03 15.88,28.04 16.89,28.04 17.91,28.04 18.92,28.04 19.94,28.04 20.95,28.04 22.48,28.04 23.5,28.04 24.51,28.04 25.53,28.04
  pour Top (rank 3, no thermals): -1.27,64.77 102.87,64.77 102.87,-1.27 -1.27,-1.27
  pour Bottom (rank 2, no thermals): -2.54,66.04 104.14,66.04 104.14,-2.54 -2.54,-2.54
IMP_LT3652_SHDN  (via drill 0.41)
  Top 0.254: SJ1.1 28.14,13.89 v27.15,14.88 | v21.72,46.1 21.72,47.46 R28.2
  Top 0.406: U8.9 22.51,48.33 R28.2
  Bottom 0.254: v27.15,14.88 21.72,20.32 v21.72,46.1
IMP_MOSI
  Top 0.254: U8.21 42.95,40.41 41.88,39.34 41.73,39.34 40.72,38.33 40.72,37.26 41.07,36.91 41.5,36.91 41.88,36.52 41.88,35.61 41.33,35.05 U9.3
IMP_SCK
  Top 0.254: U8.19 39.55,37.59 40.64,36.5 41.33,36.5 41.48,36.35 41.48,35.79 41.25,35.56 U9.2
IMP_SCL  (via drill 0.41)
  Top 0.254: v59.46,14.48 59.46,16.05 U4.5 | U1.5 10.4,15.73 v10.67,16 | U3.5 41.66,1.88 41.66,2.54 42.16,3.05 50.37,3.05 v53.16,5.84
  Top 0.61: U8.22 44.65,39.57 v44.02,38.94
  Top 0.813: R30.1 v29.97,35.81 16.2,35.81 J6.P$4
  Bottom 0.254: v10.67,16 11.37,16.7 J7.P$4 | v59.46,14.48 59.46,12.14 v53.16,5.84
  Bottom 0.305: v59.46,14.48 60.45,15.47 60.45,19.56 44.07,35.94 41.02,35.94
  Bottom 0.61: v44.02,38.94 41.02,35.94 40.89,35.81 v29.97,35.81
  Bottom 1.676: J7.P$4 J6.P$4 J5.P$4
IMP_SDA  (via drill 0.41)
  Top 0.254: U4.2 57.92,17.03 58.17,17.27 58.67,17.27 58.92,17.03 U4.4 58.92,14.98 v58.42,14.48 | U1.4 v7.87,15.24 | U3.4 41.14,2.79 41.91,3.56 49.78,3.56 v52.02,5.79
  Top 0.61: U8.14 31.05,37.95 R29.1
  Top 0.813: R29.1 v29.21,37.85 16.26,37.85 11.94,42.16 5.39,42.16 J6.P$1
  Bottom 0.254: v7.87,15.24 3.87,19.24 J7.P$1 | v58.42,14.48 58.42,12.19 v52.02,5.79
  Bottom 0.305: v29.21,37.85 29.21,35.53 29.69,35.05 44.2,35.05 59.94,19.3 59.94,16 v58.42,14.48
  Bottom 1.676: J5.P$1 J6.P$1 J7.P$1
LED_G
  Top 0.406: R25.1 24.08,58.53 U8.3
LED_R
  Top 0.305: R26.1 19.98,52.4 R27.1
  Top 0.406: R26.1 22.81,55.23 22.81,55.83 23.81,56.83 U8.4
LMZ22010_EN  (via drill 0.41)
  Top 0.406: U8.11 27.15,44.93 v27.43,44.65
  Top 0.813: U5.4 v78.74,19.48 R17.2
  Bottom 0.406: v78.74,19.48 57.84,40.39 28.45,40.39 27.43,41.4 v27.43,44.65
N$1
  Top 0.406: U8.2 21.91,60.23
  Top 0.61: 21.91,60.23 Q2.C
  Top 1.016: 21.88,60.23 Q2.C
N$2  (via drill 0.41)
  Top 0.406: 19.78,60.07 R24.2 22.35,58.17 v22.86,58.67 | v22.86,53.85 23.27,53.43 U8.6
  Top 0.61: Q2.E 19.78,60.07
  Bottom 0.406: v22.86,58.67 v22.86,53.85
N$3
  Top 0.305: R25.2 18.54,54.7 18.54,50.42 19.6,49.36 D8.P$3
N$4
  Top 0.305: R26.2 19.05,53.17 19.05,51.18 20.02,50.21 D8.P$4
N$5
  Top 0.406: C24.1 62.65,49.99 U6.1
N$6
  Top 0.406: D7.C 39.15,12.27 R10.2
N$7
  Top 0.813: U5.7 82.55,16 83.06,15.49 84.71,15.49 85.85,16.64 R18.1 R19.1 87.88,16.65 C17.2
N$8
  Top 0.813: U5.8 C16.1
N$9
  Top 0.406: U6.2 59.84,52.07
  Top 0.61: R21.2 59.84,52.07 R20.1
N$10
  Top 0.254: R9.2 R8.1 32.65,12.95 SJ1.3
N$11  (via drill 0.41)
  Top 0.406: R14.2 41.54,19.39 v41.53,19.41 | R12.1 43.07,25.71 R13.2 43.32,23.62 v43.97,23.62 | v41.53,16 41.2,15.67 D7.A
  Bottom 0.406: v41.53,16 v41.53,19.41 41.53,21.18 v43.97,23.62
N$13
  Top 0.254: R5.2 D3.C
N$15
  Top 0.406: Q1.1 3.64,20.49 R2.1 6.44,19.64 D1.A 8.13,18.45 R3.2
N$16
  Top 0.254: R4.2 D2.C
N$19
  Top 0.305: U7.8 73.15,44.19 | 73.15,44.19 72.86,44.19 Y1.3 | C27.2 72.76,43.8 73.15,44.19
N$21
  Top 0.813: D6.A 39.02,28.62 D5.A
N$23
  Top 0.254: U1.10 2.29,13.73 R1.1
  pour Top (no thermals): 6.1,11.68 4.83,11.68 3.3,13.21 1.27,13.21 1.27,11.18 4.06,8.38 6.1,8.38
N$25
  Top 0.254: R16.2 57.92,23.11 U4.9 U4.8
  pour Top (no thermals): 58.42,24.13 61.93,24.13 62.43,23.62 62.43,22.61 61.93,22.1 58.42,22.1
N$33
  Top 0.254: R15.2 40.14,9.14 U3.9 U3.8
  pour Top (no thermals): 40.89,10.16 42.67,10.16 43.18,9.65 44.2,9.65 44.2,8.13 40.89,8.13 40.64,8.38 40.64,9.91
P10_A
  Top 0.406: J8.2 70.54,59 70.54,56.97 71.12,56.39 72.95,56.39 73.43,55.91 77.06,55.91 80.41,52.56 U7.28
P10_B
  Top 0.406: J8.4 73.03,59.05 73.03,57.23 73.79,56.46 77.6,56.46 81.21,52.85 U7.27
P10_LATCH
  Top 0.61: J8.10 78.07,59.02 78.08,59.02 78.08,57.1 82.01,53.17 U7.26
P10_OE
  Top 0.406: U7.1 75.72,54.84 75.23,55.32 73.2,55.32 72.9,55.63 70.87,55.63 69.22,57.28 J8.1 67.4,55.97 R22.2
SENSE
  Top 0.406: U2.10 34.47,23.09 35.18,23.8 37.24,23.8 38.1,24.66 39.37,24.66 R11.1 | L1.P$2 33.91,29.08
  Top 1.016: 33.91,29.08 34.01,29.08 36.12,26.98 38.45,26.98 R11.1
SHDN  (via drill 0.41)
  Top 0.254: U2.3 34.47,17.4 v34.19,17.12 | v29.87,14.17 29.57,14.17 28.96,13.56 SJ1.2
  Bottom 0.254: v34.19,17.12 32.82,17.12 v29.87,14.17
SW
  Top 0.406: U2.12 33.17,24.32 | 32.23,25.26 C6.1
  pour Top (no thermals): 33.27,22.05 33.27,25.65 29.21,29.72 27.18,29.72 27.18,26.16 31.29,22.05
TIMER  (via drill 0.41)
  Top 0.406: v39.24,14.63 40.27,13.6 C8.1 | v37.24,17.91 36.92,18.22 U2.6
  Bottom 0.406: v37.24,17.91 39.24,15.9 v39.24,14.63
UART_AVR->IMP  (via drill 0.41)
  Top 0.406: U8.12 28.75,43.23 v29.41,42.57 | v77.7,48.23 78.01,48.55 U7.31
  Bottom 0.406: v29.41,42.57 49.78,42.57 51.28,44.07 73.53,44.07 v77.7,48.23
UART_IMP->AVR  (via drill 0.41)
  Top 0.406: U7.30 78.81,47.67 v78.56,47.42 | U8.20 41.25,42.47 41.81,43.03 45.36,43.03 46.66,41.73 v47.7,41.73
  Bottom 0.406: v47.7,41.73 49.76,41.73 51.51,43.48 74.62,43.48 v78.56,47.42
VBATT
  pour Top (no thermals): 43.18,10.16 44.7,10.16 46.23,8.64 49.78,8.64 49.78,11.68 43.18,11.68
VFB  (via drill 0.41)
  Top 0.254: 36.49,22.35 U2.7
  Top 0.406: v37.34,22.35 36.49,22.35 | R13.1 41.51,23.62 v40.87,23.62
  Bottom 0.406: v40.87,23.62 39.6,22.35 v37.34,22.35
VIN  (via drill 0.41)
  Top 0.254: 29.74,15.75 R6.2 R8.2 31.62,13.97 v31.37,14.22 | v28.96,5.97 29.07,6.08 D3.A D2.A
  Top 0.406: U2.1 33.17,17.93 31.01,15.77 | Q1.2 3.64,22.19 R2.2 6.44,23.04 D1.C
  Bottom 0.254: v31.37,14.22 31.37,8.38 v28.96,5.97
  pour Top (no thermals): 3.05,21.72 7.75,21.72 12.7,16.76 12.7,15.49 27.43,15.49 27.94,14.99 32.51,14.99 33.27,15.75 33.27,18.54 15.49,18.54 9.4,24.89 3.05,24.89
VIN_REG
  Top 0.254: R7.2 R6.1 33.45,15.97 33.45,17.42 33.82,17.8 U2.2
VSOLAR
  pour Top (no thermals): 6.6,11.68 13.46,11.68 13.46,8.38 6.6,8.38
VSOLAR_TO_CHARGER
  Top 0.254: U1.8 U1.9 2.29,14.23 R1.2
  pour Top (no thermals): 1.02,21.84 1.02,15.24 1.52,14.73 3.05,14.73 3.3,14.73 3.3,19.56 2.03,20.83 2.03,21.84
VSUPPLY
  pour Top (rank 2, no thermals): 76.56,22.63 68.33,22.61 68.33,40.51 61.57,47.27 59.56,47.27 59.56,42.72 62.74,39.55 62.74,21.08 66.55,17.27 76.56,17.27

### Text on the board
tPlace: ECE459 / Bus Stop Kiosk / Rev. 2 | SOL | GND | BATT | GND | 5V | D | C | GND | 5V | GND | CHRG | FAULT | Designed by / Jianan Li